# EAGLE design v2 (EAGLE 6.5.0)
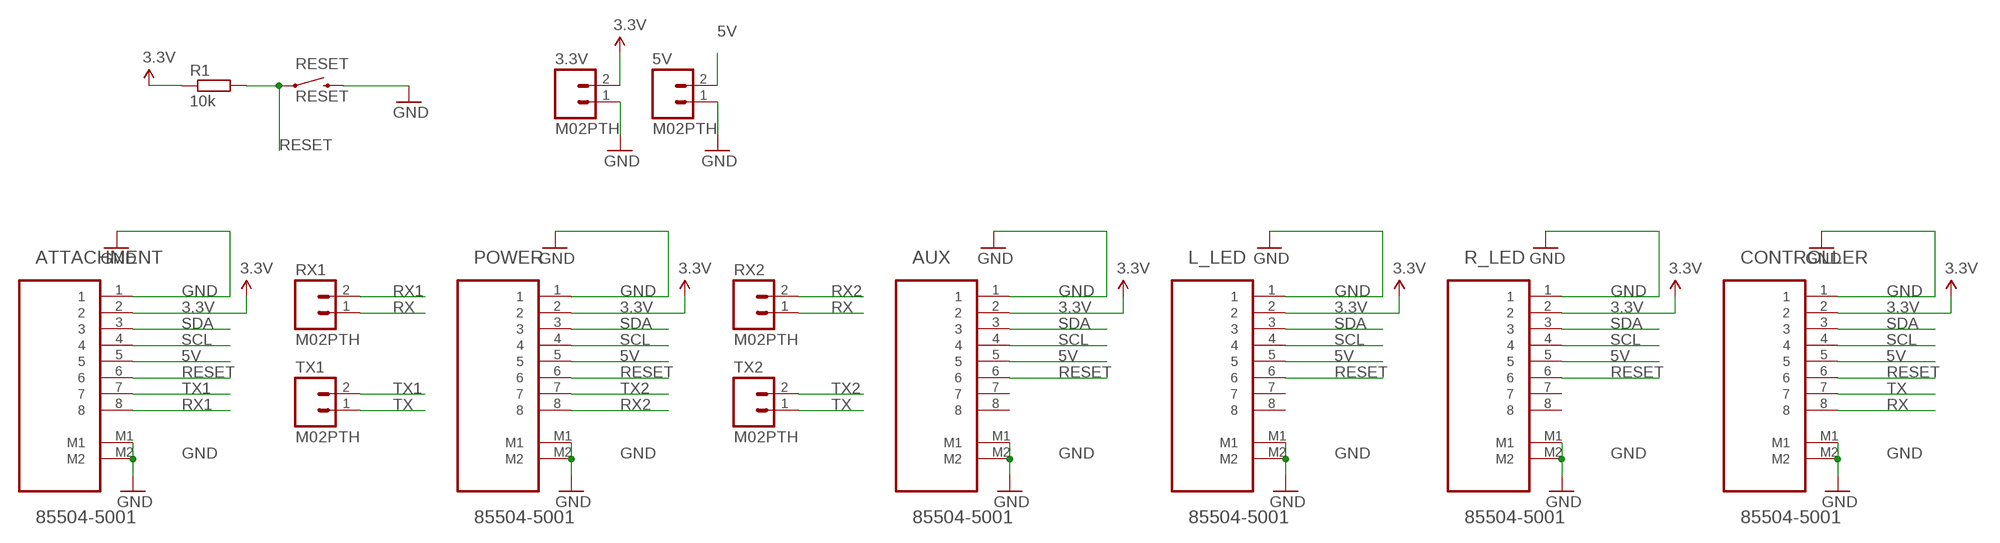
[diagram p0: schematic, sheet 1]

## Parts
3.3V  M02PTH  [1X02]
5V  M02PTH  [1X02]
ATTACHMENT  85504-5001  [MOLEX_85504-5001]
AUX  85504-5001  [MOLEX_85504-5001]
CONTROLLER  85504-5001  [MOLEX_85504-5001]
L_LED  85504-5001  [MOLEX_85504-5001]
POWER  85504-5001  [MOLEX_85504-5001]
R1  10k  R-EU_R0805  [R0805]
R_LED  85504-5001  [MOLEX_85504-5001]
RESET  RESET  SWITCH-MOMENTARY-2PTH  [TACTILE-PTH]
RX1  M02PTH  [1X02]
RX2  M02PTH  [1X02]
TX1  M02PTH  [1X02]
TX2  M02PTH  [1X02]

## Nets
3.3V: 3.3V.2 ATTACHMENT.2 AUX.2 CONTROLLER.2 L_LED.2 POWER.2 R1.1 R_LED.2
5V: 5V.2 ATTACHMENT.5 AUX.5 CONTROLLER.5 L_LED.5 POWER.5 R_LED.5
GND: 3.3V.1 5V.1 ATTACHMENT.1 ATTACHMENT.M1 ATTACHMENT.M2 AUX.1 AUX.M1 AUX.M2 CONTROLLER.1 CONTROLLER.M1 CONTROLLER.M2 L_LED.1 L_LED.M1 L_LED.M2 POWER.1 POWER.M1 POWER.M2 R_LED.1 R_LED.M1 R_LED.M2 RESET.3
RESET: ATTACHMENT.6 AUX.6 CONTROLLER.6 L_LED.6 POWER.6 R1.2 R_LED.6 RESET.1
RX: CONTROLLER.8 RX1.1 RX2.1
RX1: ATTACHMENT.8 RX1.2
RX2: POWER.8 RX2.2
SCL: ATTACHMENT.4 AUX.4 CONTROLLER.4 L_LED.4 POWER.4 R_LED.4
SDA: ATTACHMENT.3 AUX.3 CONTROLLER.3 L_LED.3 POWER.3 R_LED.3
TX: CONTROLLER.7 TX1.1 TX2.1
TX1: ATTACHMENT.7 TX1.2
TX2: POWER.7 TX2.2
Unconnected: AUX.7 AUX.8 L_LED.7 L_LED.8 R_LED.7 R_LED.8

## Library data of the parts
3.3V 5V RX1 RX2 TX1 TX2 = SparkFun-Connectors:M02: Standard 2-pin 0.1" header. Use with - straight break away headers ( PRT-00116) - right angle break away headers (PRT-00553) - swiss pins (PRT-00743) - machine pins (PRT-00117) - female headers (PRT-00115) Molex polarized connector foot print use with: PRT-08233 with associated crimp pins and housings. 2.54_SCREWTERM for use with PRT-10571. 3.5mm Screw Terminal footprints for PRT-08084 5mm Screw Terminal footprints for use with PRT-08433
ATTACHMENT AUX CONTROLLER L_LED POWER R_LED = Molex-8550x-xxxx:85504-5001: CONNECTOR, RJ45, JACK, 8P8C, 1PORT, CAT5; MPN: 85504-5001; OC_FARNELL: 2313732; OC_NEWARK: 96W3689; PACKAGE: RJ45, JACK, 8P8C; SUPPLIER: MOLEX
R1 = rcl:R-EU_: RESISTOR, European symbol
RESET = SparkFun-Electromechanical:SWITCH-MOMENTARY-2: Various NO switches- pushbuttons, reed, etc

## Board
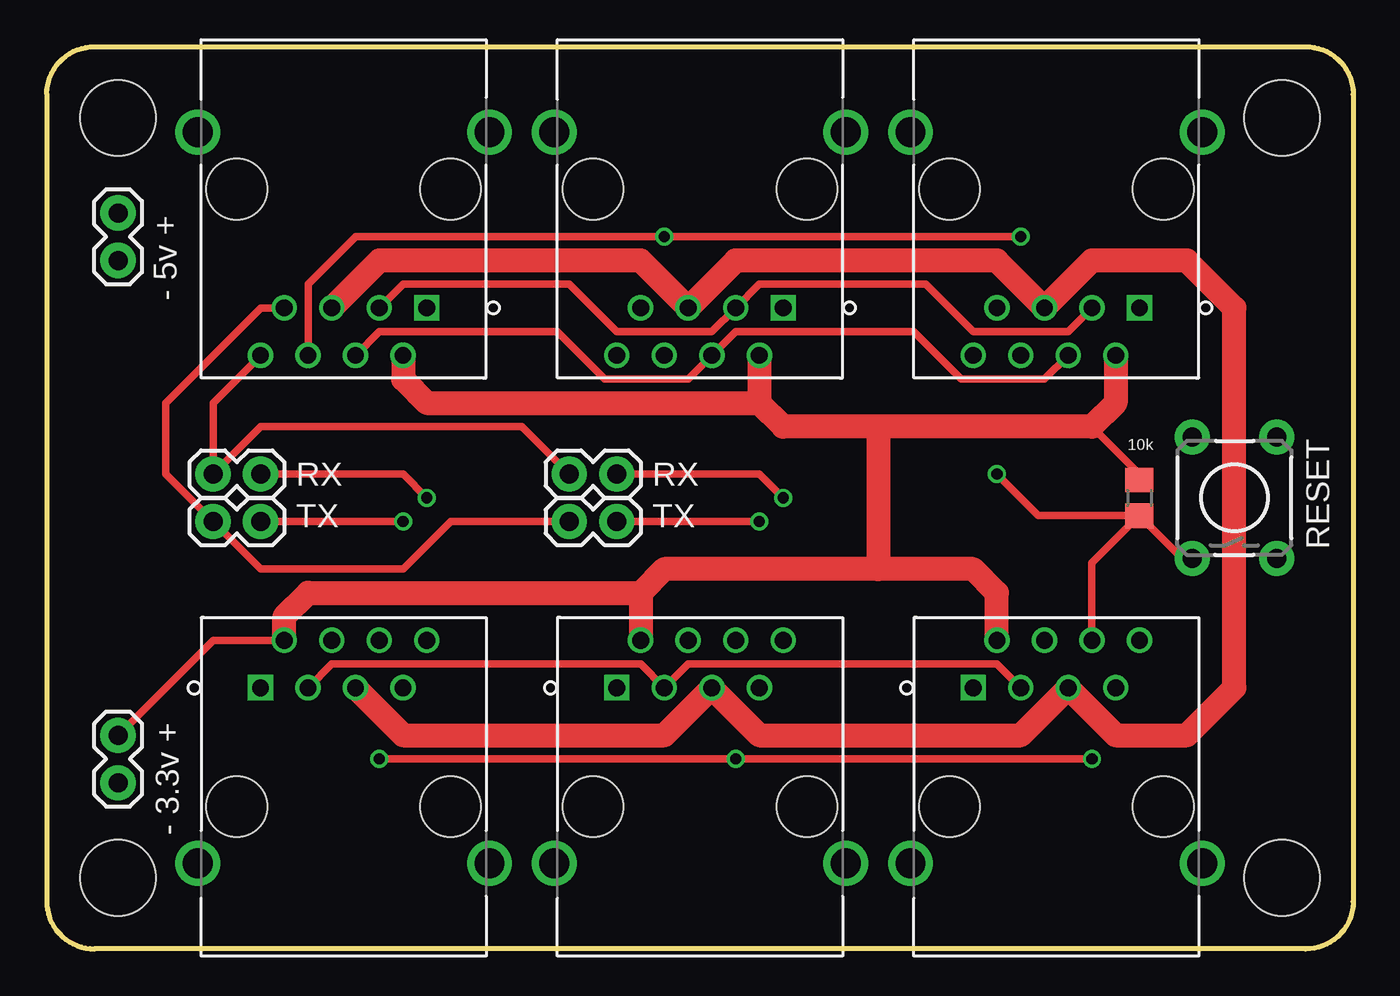
[diagram p1: board, top side]
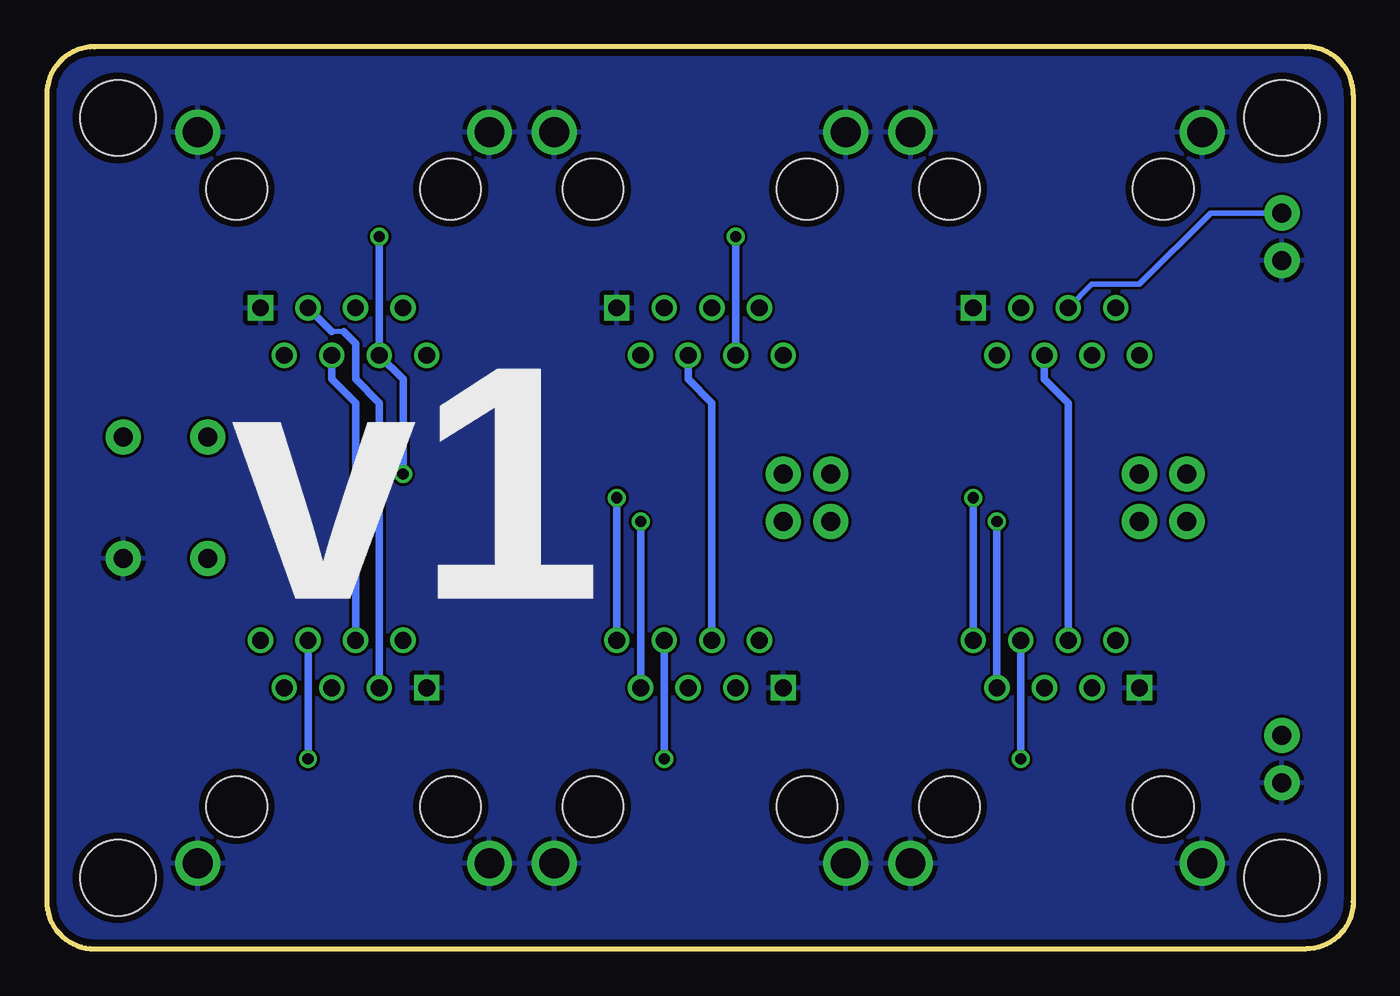
[diagram p2: board, bottom side, seen from below]

Size 69.85 x 48.26 mm. Coordinates in mm from the lower left corner, seen from the top.
Outline: 0,45.72 0,2.54 arc90 2.54,0 67.31,0 arc90 69.85,2.54 69.85,45.72 arc90 67.31,48.26 2.54,48.26 arc90 0,45.72
Copper layers (1*16): Top 0.0356mm / dielectric 1.5011mm / Bottom 0.0356mm
Design rules "LaenPCBOrder": minimum track width 6mil, minimum drill 13mil, track to track 6mil, track to pad 6mil, pad to pad 6mil, via to via 6mil, smd to smd 6mil, copper to edge 15mil, drill to drill 6mil, minimum pad ring 7mil, minimum via ring 7mil, stop-mask expansion 3mil, vias tented up to drill 0mil, thermal gap 10mil
Holes 4.06 mm at 3.81,44.45 3.81,3.81 66.04,44.45 66.04,3.81

### Footprints (pad centres in the part's own frame; a part is rotated, then mirrored left to right if it is on the bottom)
1X02 = drill 1.016 pad 1.88: 1 0,0; 2 2.54,0
MOLEX_85504-5001 = drill 0.9 square: 1 0,0 | drill 0.9: 2 1.27,2.54; 3 2.54,0; 4 3.81,2.54; 5 5.08,0; 6 6.35,2.54; 7 7.62,0; 8 8.89,2.54 | drill 1.6: M1 -3.35,-9.4; M2 12.24,-9.4 | hole 3.25: -1.27,-6.35; 10.16,-6.35
R0805 = smd 1.3 x 1.5: 1 -0.95,0; 2 0.95,0
TACTILE-PTH = drill 1.016 pad 1.88: 1 -3.251,2.261; 2 3.251,2.261; 3 -3.251,-2.261; 4 3.251,-2.261

### Placement (x,y rotation side)
3.3V  3.81,8.89 90 top
5V  3.81,36.83 90 top
ATTACHMENT  11.43,13.97 0 top
AUX  49.53,13.97 0 top
CONTROLLER  20.32,34.29 180 top
L_LED  58.42,34.29 180 top
POWER  30.48,13.97 0 top
R1  58.42,24.13 270 top
R_LED  39.37,34.29 180 top
RESET  63.5,24.13 90 top
RX1  8.89,25.4 0 top
RX2  27.94,25.4 0 top
TX1  8.89,22.86 0 top
TX2  27.94,22.86 0 top

### Tracks (layer width: path | path; a pad name or v marks a point on that pad's centre or on a via)
3.3V
  Top 0.254: R1.1 58.42,25.4
  Top 0.406: 58.42,25.4 55.88,27.94 | ATTACHMENT.2 8.89,16.51 3.3V.2
  Top 1.27: R_LED.2 38.1,29.21 | L_LED.2 57.15,29.21 55.88,27.94 44.45,27.94 | 44.45,27.94 39.37,27.94 38.1,29.21 | 31.75,19.05 POWER.2 | AUX.2 50.8,19.05 49.53,20.32 44.45,20.32 | 44.45,20.32 33.02,20.32 31.75,19.05 | 44.45,27.94 44.45,20.32 | ATTACHMENT.2 12.7,17.78 13.97,19.05 31.75,19.05 | CONTROLLER.2 19.05,30.48 20.32,29.21 38.1,29.21
5V
  Top 1.27: ATTACHMENT.5 19.05,11.43 33.02,11.43 POWER.5 38.1,11.43 52.07,11.43 AUX.5 57.15,11.43 60.96,11.43 63.5,13.97 63.5,34.29 60.96,36.83 55.88,36.83 L_LED.5 50.8,36.83 36.83,36.83 R_LED.5 31.75,36.83 17.78,36.83 CONTROLLER.5
  Bottom 0.305: 5V.2 7.62,39.37 11.43,35.56 13.97,35.56 CONTROLLER.5
GND
  pour Bottom: 0,48.26 69.85,48.26 69.85,0 0,0
RESET  (via drill 0.6)
  Top 0.406: v52.07,38.1 v33.02,38.1 16.51,38.1 13.97,35.56 CONTROLLER.6 | v55.88,10.16 v36.83,10.16 v17.78,10.16 | R1.2 55.88,20.64 AUX.6 | RESET.1 60.72,20.88 R1.2 | R1.2 53.02,23.18 v50.8,25.4
  Bottom 0.406: R_LED.6 v33.02,38.1 | v52.07,38.1 L_LED.6 50.8,30.48 v50.8,25.4 | AUX.6 v55.88,10.16 | v17.78,10.16 ATTACHMENT.6 | POWER.6 v36.83,10.16
RX
  Top 0.406: CONTROLLER.8 8.89,29.21 RX1.1 11.43,27.94 25.4,27.94 RX2.1
RX1  (via drill 0.6)
  Top 0.406: v20.32,24.13 19.05,25.4 RX1.2
  Bottom 0.406: v20.32,24.13 ATTACHMENT.8
RX2  (via drill 0.6)
  Top 0.406: RX2.2 38.1,25.4 v39.37,24.13
  Bottom 0.406: POWER.8 v39.37,24.13
SCL
  Top 0.406: L_LED.4 53.34,30.48 48.9,30.48 46.35,33.02 36.83,33.02 R_LED.4 34.29,30.48 29.84,30.48 27.3,33.02 17.78,33.02 CONTROLLER.4
  Bottom 0.406: AUX.4 53.34,29.21 54.61,30.48 L_LED.4 | POWER.4 34.29,29.21 35.56,30.48 R_LED.4 | ATTACHMENT.4 15.24,29.21 16.51,30.48 CONTROLLER.4
SDA
  Top 0.406: L_LED.3 54.61,33.02 49.53,33.02 46.99,35.56 38.1,35.56 R_LED.3 35.56,33.02 30.48,33.02 27.94,35.56 19.05,35.56 CONTROLLER.3 | ATTACHMENT.3 15.24,15.24 31.75,15.24 POWER.3 34.29,15.24 50.8,15.24 AUX.3
  Bottom 0.254: 53.98,33.02 54.61,33.02
  Bottom 0.406: AUX.3 52.07,29.21 53.34,30.48 53.34,32.38 53.98,33.02 | 54.61,33.02 L_LED.3
TX
  Top 0.406: CONTROLLER.7 11.43,34.29 6.35,29.21 6.35,25.4 TX1.1 11.43,20.32 19.05,20.32 21.59,22.86 TX2.1
TX1  (via drill 0.6)
  Top 0.406: v19.05,22.86 TX1.2
  Bottom 0.406: ATTACHMENT.7 v19.05,22.86
TX2  (via drill 0.6)
  Top 0.406: TX2.2 v38.1,22.86
  Bottom 0.406: v38.1,22.86 POWER.7

### Text on the board
_tsilk: - 5v + | RX | RX | TX | TX | - 3.3v +
_bsilk: v1